# Altium schematic sheet Blockschema_RX-1CH-400k-950M.SchDoc: Technical Block Schematic
size A4; Engineer: Tobias Batt; Organization: PrecisionWave AG; Address1: Dammstrasse 1; Address2: 4500 Solothurn; Address3: Switzerland; Revision: B; SheetNumber: 1; SheetTotal: 1; Project: Broadcast Receiver VBI-Daughterboard; Version: 1; ProjectName: Project
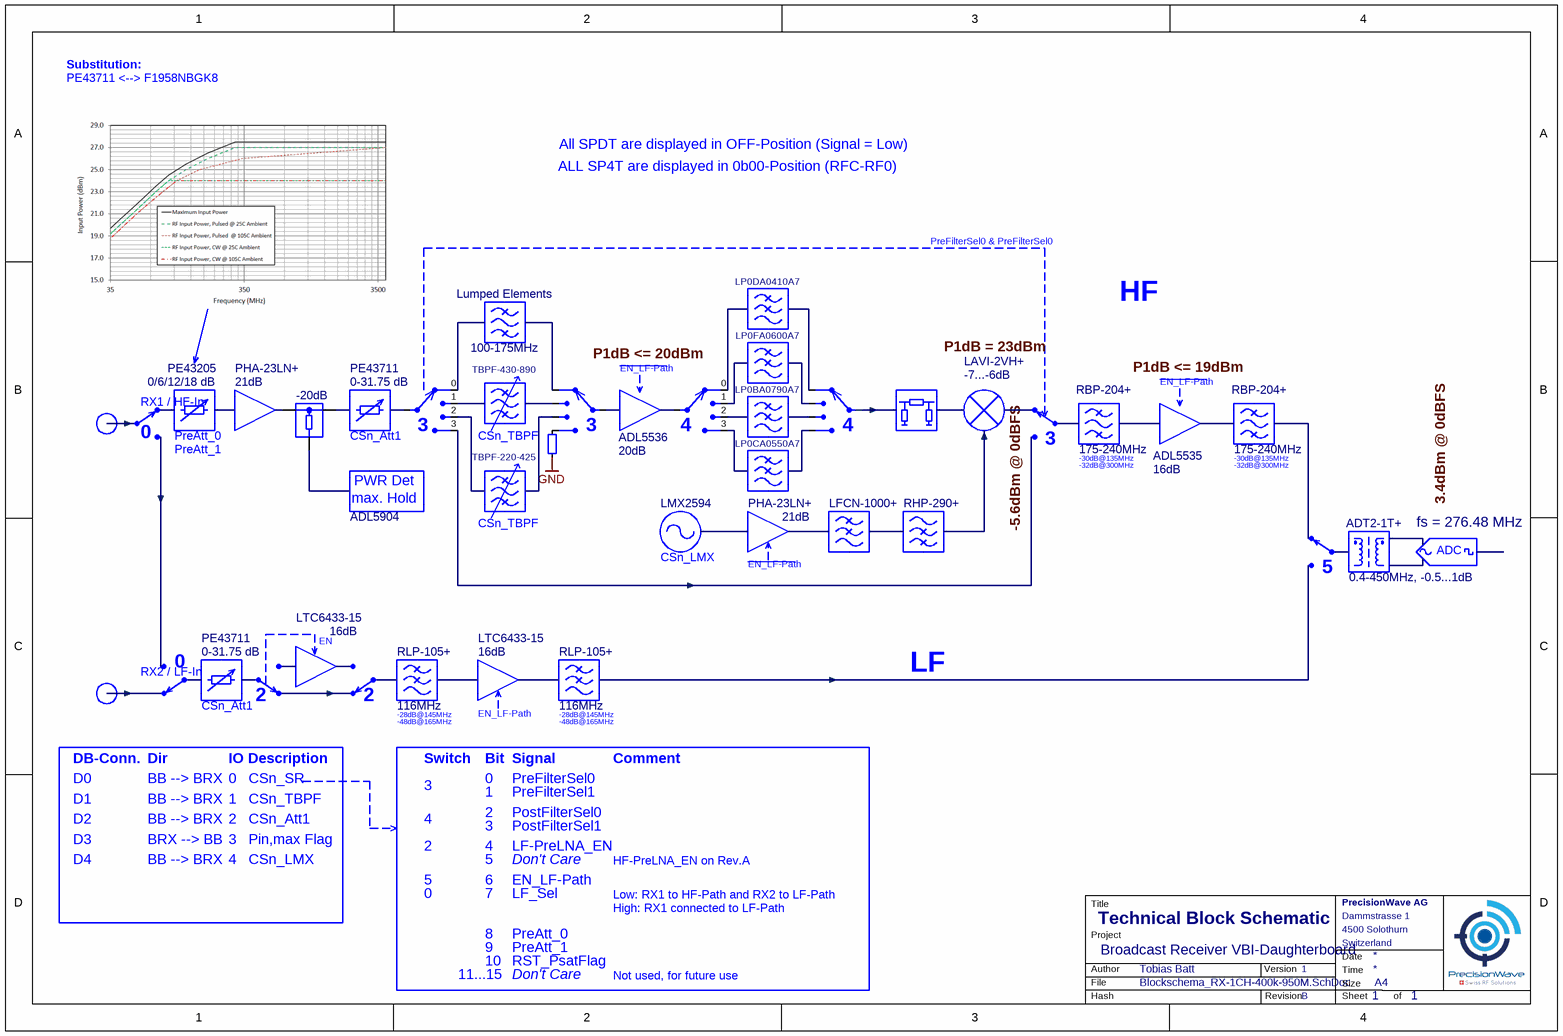
[diagram p0: Blockschema_RX-1CH-400k-950M.SchDoc]

## Parts
(Parts that share a designator on the sheet are numbered #1, #2 ... from top to bottom, then left to right.)
*#1  LP0DA0410A7
*#2  -20dB
*#3  SP4T  (value not drawn)
*#4  Att_pi  (value not drawn)
*#5  LAVI-2VH+  value -7...-6dB
*#6  SPDT_small  (value not drawn)
*#7  RBP-204+  value 175-240MHz
*#8  ADL5904
*#9  TBPF-220-425
*#10  value LMX2594  (hidden comment: Synth)
*#11  ADT2-1T+  value 0.4-450MHz, -0.5...1dB
*?#1  Lumped Elements  value 100-175MHz
*?#2  LP0FA0600A7
*?#3  TBPF-430-890
*?#4  PHA-23LN+  value 21dB
*?#5  SP4T  (value not drawn)
*?#6  ADL5536  value 20dB
*?#7  SP4T  (value not drawn)
*?#8  SP4T  (value not drawn)
*?#9  LP0BA0790A7
*?#10  RBP-204+  value 175-240MHz
*?#11  ADL5535  value 16dB
*?#12  LP0CA0550A7
*?#13  PHA-23LN+  value 21dB
*?#14  value LFCN-1000+  (hidden comment: LPF)
*?#15  value RHP-290+  (hidden comment: HPF)
*?#16  SPDT_small  (value not drawn)
*?#17  value fs = 276.48 MHz  (hidden comment: ADS5263)
*?#18  LTC6433-15  value 16dB
*?#19  SPDT_small  (value not drawn)
*?#20  SPDT_small  (value not drawn)
*?#21  RLP-105+  value 116MHz
*?#22  LTC6433-15  value 16dB
*?#23  RLP-105+  value 116MHz
AT1  PE43205  value 0/6/12/18 dB
AT3  PE43711  value 0-31.75 dB
AT?  PE43711  value 0-31.75 dB
R?  49.9  [0402R]  (value not drawn)
S3  SPDT_small  (value not drawn)
S7  SPDT_small  (value not drawn)

## Nets
GND: R?.1
Net*#1_1: *#1.1 *?#7.6
Net*#1_2: *#1.2 *?#8.6
Net*#2_9: *#2.9 AT?.1
Net*#2_10: *#2.10 *#8.1
Net*#3_1: *#3.1 AT?.2
Net*#3_6: *#3.6 *?#1.1
Net*#3_7: *#3.7 *?#3.1
Net*#3_8: *#3.8 *#9.1
Net*#3_9: *#3.9 *#6.5
Net*#4_1: *#4.1 *?#8.1
Net*#4_2: *#4.2 *#5.a(GND)
Net*#5_a: *#5.a(GND) *#6.7
Net*#5_a: *#5.a(GND) *?#15.2  [a separate net that carries the same name]
Net*#6_1: *#6.1 *?#10.1
Net*#7_1: *#7.1 *?#11.8
Net*#7_2: *#7.2 *?#16.7
Net*#9_2: *#9.2 *?#5.8
Net*#10_15: *#10.15 *?#13.5
Net*#11_12: *#11.12 *?#16.1
Net*#11_15: *#11.15 *?#17.8
Net*#11_17: *#11.17 *?#17.3
Net*?#1_2: *?#1.2 *?#5.6
Net*?#2_1: *?#2.1 *?#7.7
Net*?#2_2: *?#2.2 *?#8.7
Net*?#3_2: *?#3.2 *?#5.7
Net*?#4_5: *?#4.5 AT1.2
Net*?#5_1: *?#5.1 *?#6.5
Net*?#5_9: *?#5.9 R?.2
Net*?#6_8: *?#6.8 *?#7.1
Net*?#7_8: *?#7.8 *?#9.1
Net*?#7_9: *?#7.9 *?#12.1
Net*?#8_8: *?#8.8 *?#9.2
Net*?#8_9: *?#8.9 *?#12.2
Net*?#10_2: *?#10.2 *?#11.5
Net*?#13_8: *?#13.8 *?#14.1
Net*?#14_2: *?#14.2 *?#15.1
Net*?#16_5: *?#16.5 *?#23.2
Net*?#18_5: *?#18.5 *?#19.5
Net*?#18_8: *?#18.8 *?#20.5
Net*?#19_1: *?#19.1 AT3.2
Net*?#19_7: *?#19.7 *?#20.7
Net*?#20_1: *?#20.1 *?#21.1
Net*?#21_2: *?#21.2 *?#22.5
Net*?#22_8: *?#22.8 *?#23.1
NetAT1_1: AT1.1 S3.7
NetAT3_1: AT3.1 S7.1
NetS3_5: S3.5 S7.5

Not connected (* = marked no-connect by the designer): *#1 3 4 5 6 7; *#2 8; *#4 3 4 5 6; *#7 3 4 5 6 7 8; *#8 2 3 4 5 6 7; *#9 3 4 5 6 7 8; *#10 14 16 17; *#11 13 14 16; *?#1 3 4 5 6 7 8; *?#2 3 4 5 6 7; *?#3 3 4 5 6 7 8; *?#4 6 7 8 9 10 11 12; *?#6 6 7 9 10 11 12; *?#9 3 4 5 6 7; *?#10 3 4 5 6 7 8; *?#11 6 7 9 10 11 12; *?#12 3 4 5 6 7; *?#13 6 7 9 10 11 12; *?#14 3 4 5 6 7; *?#15 3 4 5 6 7; *?#17 7 9 10 11; *?#18 6 7 9 10 11 12; *?#21 3 4 5 6 7; *?#22 6 7 9 10 11 12; *?#23 3 4 5 6 7; AT1 3 4 5 6 7 8; AT3 3 4 5 6 7 8; AT? 3 4 5 6 7 8; S3 1; S7 7

## Notes on the sheet
- Substitution:
- PE43711 <--> F1958NBGK8
- ALL SP4T are displayed in 0b00-Position (RFC-RF0)
- All SPDT are displayed in OFF-Position (Signal = Low)
- PreFilterSel0 & PreFilterSel0
- HF
- (near *#3) 0
- (near *?#7) P1dB <= 20dBm
- (near *?#7) EN_LF-Path
- (near *?#7) 0
- (near *#5) P1dB = 23dBm
- P1dB <= 19dBm
- EN_LF-Path
- (near S3) RX1 / HF-In
- (near S3) 0
- (near AT1) PreAtt_0
- (near AT?) CSn_Att1
- (near *#3) 3
- (near *#3) 1
- (near *#3) 2
- (near *?#3) CSn_TBPF
- (near *?#5) 3
- (near *?#7) 4
- (near *?#7) 1
- (near *?#7) 2
- (near *?#7) 3
- (near *?#8) 4
- (near *#6) 3
- PreAtt_1
- (near *?#10) -30dB@135MHz
- (near *?#10) -32dB@300MHz
- (near *#7) -30dB@135MHz
- (near *#7) -32dB@300MHz
- (near *?#17) 3.4dBm @ 0dBFS
- (near *#9) CSn_TBPF
- (near *#10) CSn_LMX
- (near *?#13) EN_LF-Path
- (near *#5) -5.6dBm @ 0dBFS
- (near *?#16) 5
- (near *?#18) EN
- (near S7) RX2 / LF-In
- (near S7) 0
- (near AT3) CSn_Att1
- (near *?#19) 2
- (near *?#20) 2
- (near *?#21) -28dB@145MHz
- (near *?#22) EN_LF-Path
- (near *?#23) -28dB@145MHz
- LF
- DB-Conn.
- D0
- Dir
- BB --> BRX
- IO Description
- 0
- CSn_SR
- (near *?#21) -48dB@165MHz
- (near *?#21) Switch
- 3
- Bit
- (near *?#23) Signal
- PreFilterSel0
- (near *?#23) -48dB@165MHz
- (near *?#23) Comment
- D1
- D2
- D3
- BRX --> BB
- 1
- 2
- CSn_TBPF
- CSn_Att1
- Pin,max Flag
- 4
- PreFilterSel1
- PostFilterSel0
- PostFilterSel1
- LF-PreLNA_EN
- D4
- CSn_LMX
- 5
- 6
- 7
- LF_Sel
- Don't Care
- HF-PreLNA_EN on Rev.A
- Low: RX1 to HF-Path and RX2 to LF-Path
- High: RX1 connected to LF-Path
- 11...15
- 8
- 9
- 10
- PreAtt_0
- RST_PsatFlag
- Not used, for future use
- Title
- File
- Author
- Project
- Version
- Size
- Date
- Time
- A4
- Hash
- Revision
- Sheet
- of
- (in symbol ADC_2) ADC

## Library data of the parts
*#1 *?#2 *?#9 *?#12 *?#21 *?#23 = LPF: Manufacturer: *; Manufacturer Part Number: *
  *#1 *?#2 *?#9 *?#12: Value: *
*#2 = Power Signal Tap
*#5 = Mixer_2: Manufacturer: *; Manufacturer Part Number: *
*#7 *?#1 *?#10 = BPF: Manufacturer: *; Manufacturer Part Number: *
*#8 = GenericBlock_3: Value2: max. Hold; Value1: PWR Det; Manufacturer: *
*#9 *?#3 = BPF_VAR: Manufacturer: *; Manufacturer Part Number: *; Value: *
*#11 = BALUN: Manufacturer: *; Manufacturer Part Number: *
*?#4 *?#6 *?#11 *?#13 *?#18 *?#22 = Gainblock_2: Manufacturer: *
  *?#6 *?#11 *?#13 *?#18 *?#22: Manufacturer Part Number: *
*?#17 = ADC_2: Manufacturer: ADC 1 of 4; Manufacturer Part Number: *
AT1 AT3 AT? = Att_var: Manufacturer: *; Manufacturer Part Number: *
R? = 111052: RES, 49.9 Ohm, 62.5mW, Thin Film; PCW_PartNr: 111052; Manufacturer 1: Vishay; Manufacturer Part Number 1: MCS04020C4999FE000; KeyRating: 62.5mW, 50V; Tolerance: 1%, 50ppm; Substitutable: Yes; _Life Cycle Visum: xxYYYYMMDD; Value: 49.9; Package: 0402; Mounting: SMD; _Life Cycle: ?; _Author: xxYYYYMMDD; _Reviewer: xxYYYYMMDD; _Validator: xxYYYYMMDD
*#3 *?#5 *?#7 *?#8 = SP4T: Manufacturer: *; Manufacturer Part Number: *; Value: *
*#4 = Att_pi: Manufacturer: *; Manufacturer Part Number: *; Value: *
*#6 *?#16 *?#19 *?#20 S3 S7 = SPDT_small: Manufacturer: *; Manufacturer Part Number: *; Value: *
*#10 = Synth: Manufacturer: *; Manufacturer Part Number: *
*?#14 = LPF: Manufacturer: *; Manufacturer Part Number: *
*?#15 = HPF: Manufacturer: *; Manufacturer Part Number: *